# Altium schematic sheet ECUEXT2_23.SchDoc
size A4; SheetNumber: 1; SheetTotal: 1
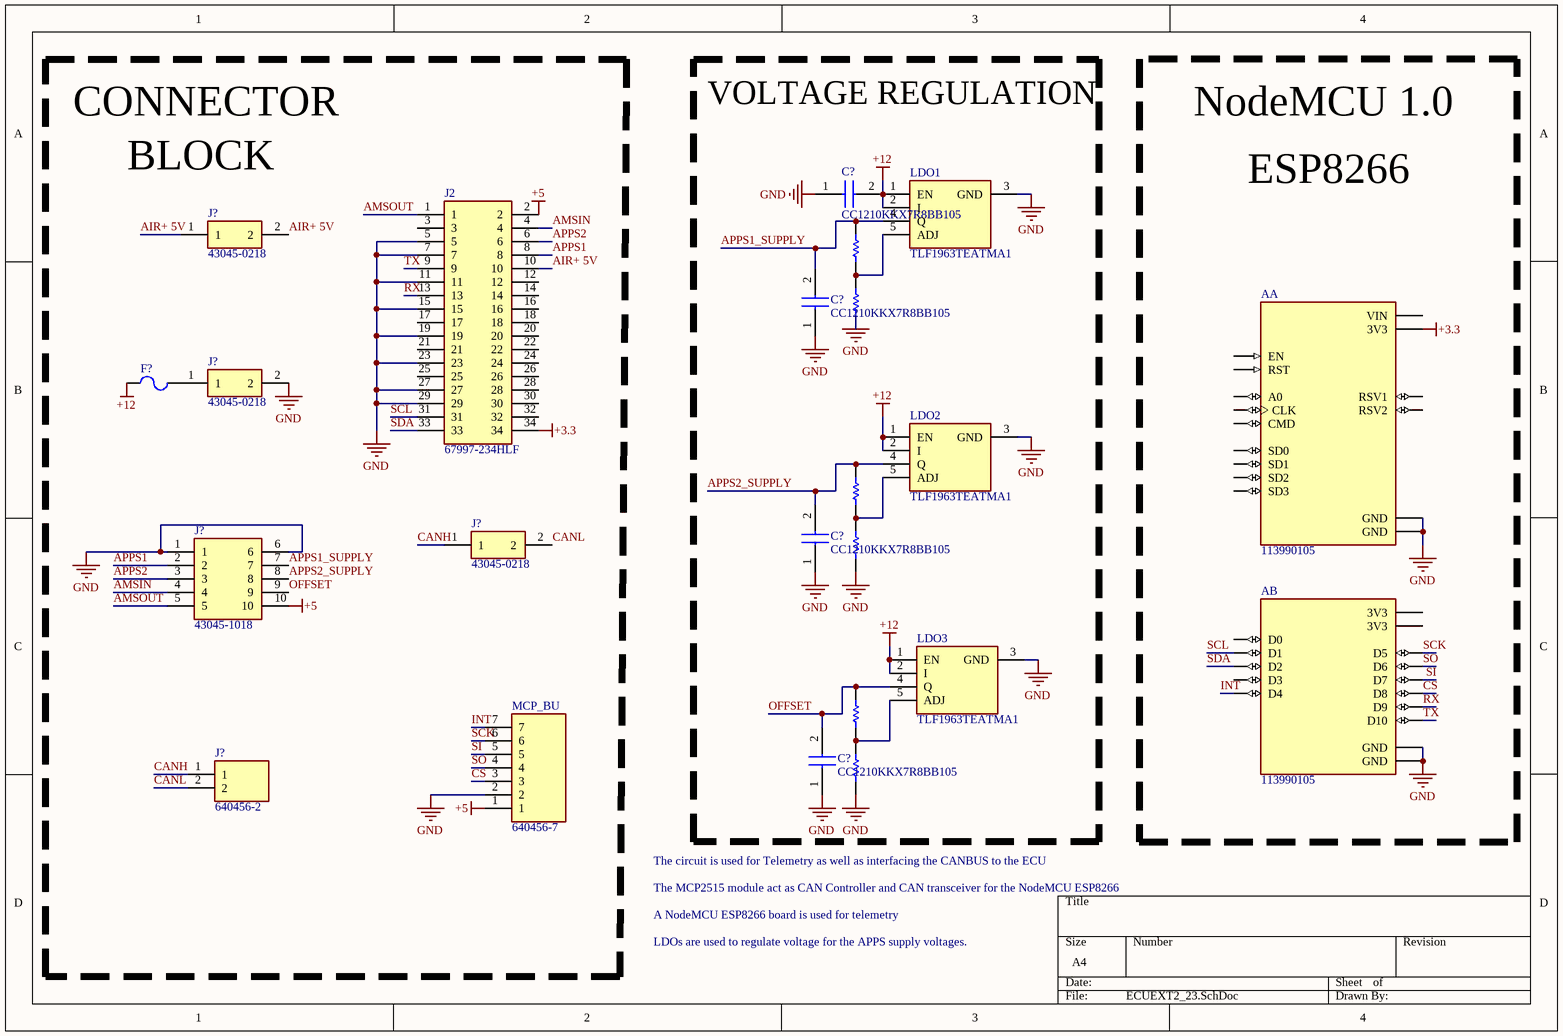
[diagram p0: ECUEXT2_23.SchDoc]

## Parts
(Parts that share a designator on the sheet are numbered #1, #2 ... from top to bottom, then left to right.)
A  113990105  [SEEED_113990105]  (parts A,B of 2)
C?#1  CC1210KKX7R8BB105  [CAPC3225X145N]
C?#2  CC1210KKX7R8BB105  [CAPC3225X145N]
C?#3  CC1210KKX7R8BB105  [CAPC3225X145N]
C?#4  CC1210KKX7R8BB105  [CAPC3225X145N]
F?  NANOSMDC020F-2  [TECO-NANOSMDC020F_V]  (value not drawn)
J2  67997-234HLF  [HDRV34W67P254_2X17_4318X483X858P]
J?#1  43045-0218  [43045-02YY_181920]
J?#2  43045-0218  [43045-02YY_181920]
J?#3  43045-0218  [43045-02YY_181920]
J?#4  43045-1018  [43045-10YY_181920]
J?#5  640456-2  [SHDR2W66P0X254_1X2_508X572X1041P]
LDO1  TLF1963TEATMA1  [TLF1963TEATMA1]
LDO2  TLF1963TEATMA1  [TLF1963TEATMA1]
LDO3  TLF1963TEATMA1  [TLF1963TEATMA1]
MCP_BU  640456-7  [6404567]
R1  RC1210JR-0710KL  [RESC3126X60X50ML10T20]  (value not drawn)
R2  RC1210JR-0710KL  [RESC3126X60X50ML10T20]  (value not drawn)
R3  RC1210JR-0710KL  [RESC3126X60X50ML10T20]  (value not drawn)
R4  RC1210JR-0710KL  [RESC3126X60X50ML10T20]  (value not drawn)
R5  RC1210JR-0710KL  [RESC3126X60X50ML10T20]  (value not drawn)
R6  RC1210JR-0710KL  [RESC3126X60X50ML10T20]  (value not drawn)

## Blocks framed on the sheet
VOLTAGE REGULATION: C?#1-C?#4 LDO1-LDO3 R1-R6

## Nets
+3.3: A.J1_11(3V3) J2.34
+5: J2.2 J?#4.10 MCP_BU.1
+12: C?#1.2 F?.1 LDO1.1(EN) LDO1.2(I) LDO2.1(EN) LDO2.2(I) LDO3.1(EN) LDO3.2(I)
GND: A.J1_10(GND) A.J1_14(GND) A.J2_7(GND) A.J2_14(GND) C?#1.1 C?#2.1 C?#3.1 C?#4.1 J2.5 J2.7 J2.11 J2.15 J2.19 J2.23 J2.27 J2.29 J?#2.2 J?#4.1 J?#4.6 LDO1.3(GND) LDO2.3(GND) LDO3.3(GND) MCP_BU.2 R2.1 R4.1 R6.1
AIR+ 5V: J2.10 J?#1.1 J?#1.2
AMSIN: J2.4 J?#4.4
AMSOUT: J2.1 J?#4.5
APPS1: J2.8 J?#4.2
APPS1_SUPPLY: C?#2.2 J?#4.7 LDO1.4(Q) R1.2
APPS2: J2.6 J?#4.3
APPS2_SUPPLY: C?#3.2 J?#4.8 LDO2.4(Q) R3.2
CANH: J?#3.1 J?#5.1
CANL: J?#3.2 J?#5.2
CS: A.J2_11(D8) MCP_BU.3
INT: A.J2_5(D4) MCP_BU.7
OFFSET: C?#4.2 J?#4.9 LDO3.4(Q) R5.2
RX: A.J2_12(D9) J2.13
SCK: A.J2_8(D5) MCP_BU.6
SCL: A.J2_2(D1) J2.31
SDA: A.J2_3(D2) J2.33
SI: A.J2_10(D7) MCP_BU.5
SO: A.J2_9(D6) MCP_BU.4
TX: A.J2_13(D10) J2.9
NetF?_2: F?.2 J?#2.1
NetLDO1_5: LDO1.5(ADJ) R1.1 R2.2
NetLDO2_5: LDO2.5(ADJ) R3.1 R4.2
NetLDO3_5: LDO3.5(ADJ) R5.1 R6.2

Not connected (* = marked no-connect by the designer): A J1_1(A0) J1_2(RSV1) J1_3(RSV2) J1_4(SD3) J1_5(SD2) J1_6(SD1) J1_7(CMD) J1_8(SD0) J1_9(CLK) J1_12(EN) J1_13(RST) J1_15(VIN) J2_1(D0) J2_4(D3) J2_6(3V3) J2_15(3V3); J2 3 12 14 16 17 18 20 21 22 24 25 26 28 30 32

## Notes on the sheet
- CONNECTOR
- BLOCK
- NodeMCU 1.0
- ESP8266
- The circuit is used for Telemetry as well as interfacing the CANBUS to the ECU
- A NodeMCU ESP8266 board is used for telemetry
- The MCP2515 module act as CAN Controller and CAN transceiver for the NodeMCU ESP8266
- LDOs are used to regulate voltage for the APPS supply voltages.

## Library data of the parts
A = 113990105: An open-source firmware and development kit that helps you to Prototype your IOT product within a few Lua script lines; MP: NodeMCU v2; MF: Seeed Technology; Availability: Unavailable; SnapEDA_Link: https://www.snapeda.com/parts/NodeMCU%20v2/Seeed%20Technology%20Co.%2C%20Ltd/view-part/378076/?ref=snap; Price: None; Value: *; Package: None
C?#1-C?#4 = CC1210KKX7R8BB105: Capacitor; Manufacturer_Name: YAGEO (PHYCOMP); Datasheet Link: https://datasheet.datasheetarchive.com/originals/distributors/Datasheets_SAMA/d9f127a4875522309d99aa7dec79633c.pdf; Height: 1.45mm; Manufacturer_Part_Number: CC1210KKX7R8BB105; Mouser Part Number: 603-CC121KKX7R8BB105; Mouser Price/Stock: https://www.mouser.com/Search/Refine.aspx?Keyword=603-CC121KKX7R8BB105; Arrow Part Number: CC1210KKX7R8BB105; Arrow Price/Stock: https://www.arrow.com/en/products/cc1210kkx7r8bb105/yageo?region=nac
F? = CMP-2000-06804-1: PolySwitch Resettable Device, 24 V, 100 A, -40 to 85 degC, 2-Pin SMD (1206), RoHS, Tape and Reel; Manufacturer: TEConnectivity/CircuitProtection; Lead Diameter: N/R; Minimum Initial Resistance: 0.65Ohm; Hold Current: 0.2A; Trip Current: 0.42A; Maximum Post Trip Resistance: 2.6Ohm; Maximum Current Rating: 100A; Agency Approvals: CSA,UL,TUV; Maximum Trip Time: 0.1@8As; Maximum Voltage Rating: 24VDC; Typical Power Dissipation: 0.6(Max)W; Terminal Pitch: N/A; Packaging: TapeandReel; Mounting Technology: SurfaceMount; Package Reference: 1206; Part No: NANOSMDC020F-2; Mounting: SurfaceMount; Datasheet Version: 02/2014; Package/Case: 1206; RoHS: Yes; Package Description: 2-Pin Surface Mount Device, Body 3.2 x 1.585 mm; Dimension: 3.4(Max)x1.8(Max)x0.82(Max)mm; Family: nanoSMD; Applications: N/A; Maximum Initial Resistance: N/A; Number of Terminals: 2; Manufacturer URL: http://www.te.com/; Datasheet URL: https://datasheet.ciiva.com/30470/0900766b812a99d0-30470053.pdf; Operating Temperature: 85(Max)C; Seated Plane Height: N/R; Wire Form: N/R
J2 = 67997-234HLF: Connector; Manufacturer_Name: Amphenol; Datasheet Link: https://cdn.amphenol-icc.com/media/wysiwyg/files/drawing/67996.pdf; Height: 8.58mm; Manufacturer_Part_Number: 67997-234HLF; Mouser Part Number: 649-67997-234HLF; Mouser Price/Stock: https://www.mouser.co.uk/ProductDetail/Amphenol-FCI/67997-234HLF?qs=zh4O8xspOuxBU73L6U2QCQ%3D%3D; Arrow Part Number: 67997-234HLF; Arrow Price/Stock: https://www.arrow.com/en/products/67997-234hlf/amphenol-fci?region=nac
J?#1-J?#3 = 43045-0218: Connector; Manufacturer_Name: Molex; Datasheet Link: https://www.molex.com/pdm_docs/sd/430450218_sd.pdf; Height: 9.91mm; Manufacturer_Part_Number: 43045-0218; Mouser Part Number: 538-43045-0218; Mouser Price/Stock: https://www.mouser.co.uk/ProductDetail/Molex/43045-0218?qs=4XSMV6Twtb2qUKINalLbdA%3D%3D; Arrow Part Number: 43045-0218; Arrow Price/Stock: https://www.arrow.com/en/products/43045-0218/molex
J?#4 = 43045-1018: Connector; Manufacturer_Name: Molex; Datasheet Link: https://www.molex.com/pdm_docs/sd/430450218_sd.pdf; Height: 9.91mm; Manufacturer_Part_Number: 43045-1018; Mouser Part Number: 538-43045-1018; Mouser Price/Stock: https://www.mouser.co.uk/ProductDetail/Molex/43045-1018?qs=KC2ywxza1kp09G%252BeESkbdg%3D%3D
J?#5 = 640456-2: Connector; Manufacturer_Name: TE Connectivity; Datasheet Link: http://www.te.com/commerce/DocumentDelivery/DDEController?Action=showdoc&DocId=Customer+Drawing%7F640456%7FW3%7Fpdf%7FEnglish%7FENG_CD_640456_W3.pdf%7F640456-2; Height: 10.414mm; Manufacturer_Part_Number: 640456-2; Mouser Part Number: 571-6404562; Mouser Price/Stock: https://www.mouser.co.uk/ProductDetail/TE-Connectivity-AMP/640456-2?qs=%2F35zJ5USjomRu3EJQJgZCQ%3D%3D; Arrow Part Number: 640456-2; Arrow Price/Stock: https://www.arrow.com/en/products/640456-2/te-connectivity?region=europe
LDO1-LDO3 = TLF1963TEATMA1: Integrated Circuit; Manufacturer_Name: Infineon; Datasheet Link: https://www.infineon.com/dgdl/Infineon-TLF1963-DS-v01_00-EN.pdf?fileId=5546d46258fc0bc1015969d2981941e0; Height: 2.35mm; Manufacturer_Part_Number: TLF1963TEATMA1; Mouser Part Number: 726-TLF1963TEATMA1; Mouser Price/Stock: https://www.mouser.co.uk/ProductDetail/Infineon-Technologies/TLF1963TEATMA1?qs=SiyfpgnvCZluIGE%2FbZiglw%3D%3D; Arrow Part Number: TLF1963TEATMA1; Arrow Price/Stock: https://www.arrow.com/en/products/tlf1963teatma1/infineon-technologies-ag?region=nac
MCP_BU = 640456-7: Connector; Manufacturer_Name: TE Connectivity; Datasheet Link: https://www.te.com/commerce/DocumentDelivery/DDEController?Action=srchrtrv&DocNm=640456&DocType=Customer+Drawing&DocLang=English&DocFormat=pdf&PartCntxt=640456-7; Height: 10.414mm; Manufacturer_Part_Number: 640456-7; Mouser Part Number: 571-6404567; Mouser Price/Stock: https://www.mouser.co.uk/ProductDetail/TE-Connectivity-AMP/640456-7?qs=%2F35zJ5USjol1zdA9I4S5nQ%3D%3D; Arrow Part Number: 640456-7; Arrow Price/Stock: https://www.arrow.com/en/products/640456-7/te-connectivity?region=europe
R1-R6 = CMP-2005-01721-1: Manufacturer: Yageo; Part Number: RC1210JR-0710KL